# Altium schematic sheet 10.TF.SchDoc
size A4; CheckedBy: YPC; DocumentNumber: 10; Revision: V1.00; SheetNumber: 10; SheetTotal: 18; SheetName: TF; SheetDescribe: TF卡; Designer: JOW; DesignDate: 2025-04-25; CheckedData: 2025-04-25
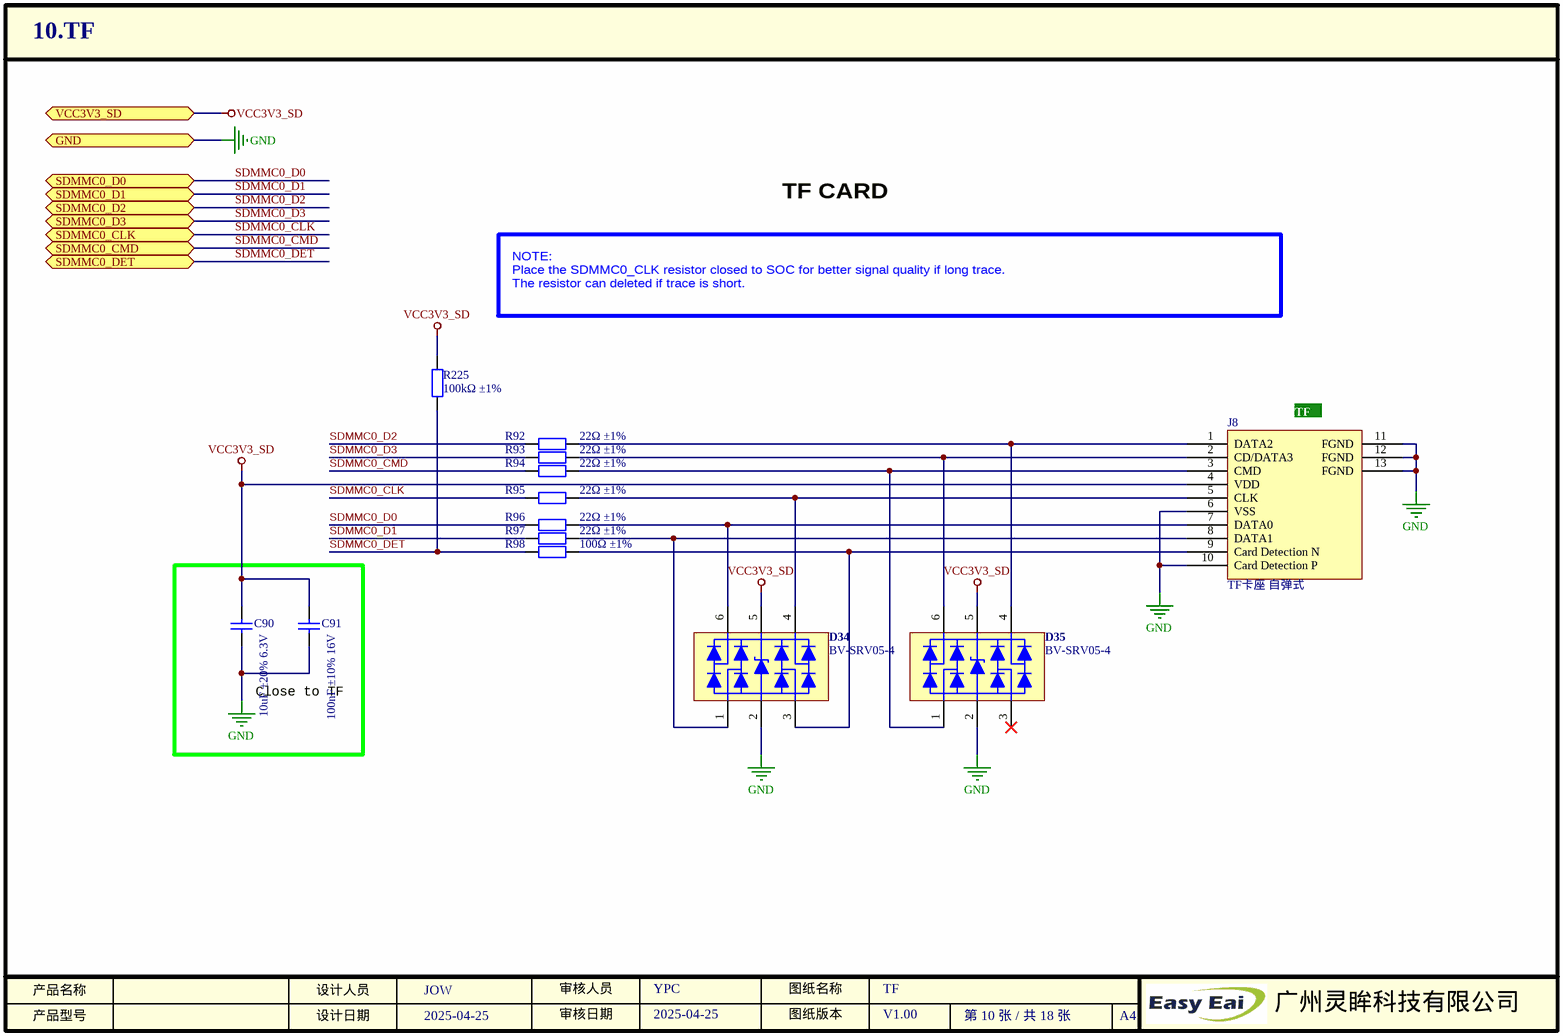
[diagram p0: 10.TF.SchDoc]

## Parts
C90  描述: 10uF ±20% 6.3V  [0402_C]  (hidden comment: CL05A106MQ5NUNC)
C91  描述: 100nF ±10% 16V  [0402_C]  (hidden comment: CL05B104KO5NNNC)
D34  BV-SRV05-4  [SOT-23-6]
D35  BV-SRV05-4  [SOT-23-6]
J8  TF-01A  [TF]  (value not drawn)
R92  描述: 22Ω ±1%  [0402_R]  (hidden comment: 0402WGF220JTCE)
R93  描述: 22Ω ±1%  [0402_R]  (hidden comment: 0402WGF220JTCE)
R94  描述: 22Ω ±1%  [0402_R]  (hidden comment: 0402WGF220JTCE)
R95  描述: 22Ω ±1%  [0402_R]  (hidden comment: 0402WGF220JTCE)
R96  描述: 22Ω ±1%  [0402_R]  (hidden comment: 0402WGF220JTCE)
R97  描述: 22Ω ±1%  [0402_R]  (hidden comment: 0402WGF220JTCE)
R98  描述: 100Ω ±1%  [0402_R]  (hidden comment: 0402WGF1000TCE)
R225  描述: 100kΩ ±1%  [0402_R]  (hidden comment: 0402WGF1003TCE)

## Blocks framed on the sheet
Close to TF: C90 C91

## Ports
GND, SDMMC0_CLK, SDMMC0_CMD, SDMMC0_D0, SDMMC0_D1, SDMMC0_D2, SDMMC0_D3, SDMMC0_DET, VCC3V3_SD

## Nets
GND: C90.1 C91.1 D34.2 D35.2 J8.6(VSS) J8.10(Card_Detection_P) J8.11(FGND) J8.12(FGND) J8.13(FGND) ; port GND
VCC3V3_SD: C90.2 C91.2 D34.5 D35.5 J8.4(VDD) R225.2 ; port VCC3V3_SD
SDMMC0_CLK: R95.1 ; port SDMMC0_CLK
SDMMC0_CMD: R94.1 ; port SDMMC0_CMD
SDMMC0_D0: R96.1 ; port SDMMC0_D0
SDMMC0_D1: R97.1 ; port SDMMC0_D1
SDMMC0_D2: R92.1 ; port SDMMC0_D2
SDMMC0_D3: R93.1 ; port SDMMC0_D3
SDMMC0_DET: R98.1 R225.1 ; port SDMMC0_DET
NetD34_1: D34.1 J8.8(DATA1) R97.2
NetD34_3: D34.3 J8.9(Card_Detection_N) R98.2
NetD34_4: D34.4 J8.5(CLK) R95.2
NetD34_6: D34.6 J8.7(DATA0) R96.2
NetD35_1: D35.1 J8.3(CMD) R94.2
NetD35_4: D35.4 J8.1(DATA2) R92.2
NetD35_6: D35.6 J8.2(CD/DATA3) R93.2

Not connected (* = marked no-connect by the designer): D35 3*

## Notes on the sheet
- TF CARD
- NOTE:
  Place the SDMMC0_CLK resistor closed to SOC for better signal quality if long trace.
  The resistor can deleted if trace is short.
- (near J8) TF
- 产品名称
- 产品型号
- 设计人员
- 设计日期
- 审核人员
- 审核日期
- 图纸版本
- 图纸名称
- A4
- 广州灵眸科技有限公司

## Library data of the parts
C90 = 0402 10uF ±20% 6.3V: SPZL000269; 名称: 贴片电容; 厂商: SAMSUNG(三星); 封装: 0402; 工作温度: -55~85℃; 贴片和直插: SMD; 型号: CL05A106MQ5NUNC; SuppliersPartNumber: C15525; 商品编号: SPZL000269
C91 = 0402 100nF ±10% 16V: SPZL000259; 名称: 贴片电容; 厂商: SAMSUNG(三星); 封装: 0402; 工作温度: -55~125℃; 贴片和直插: SMD; 型号: CL05B104KO5NNNC; SuppliersPartNumber: C1525; 商品编号: SPZL000259
D34 D35 = ESD BV-SRV05-4: SPZL000615; 名称: ESD; 厂商: Bencent(槟城); 贴片和直插: SMD; 描述: Vdrm=5V Cj=1.8pF; 工作温度: -55~125℃; 封装: SOT-23-6; SuppliersPartNumber: C409437; 商品编号: SPZL000615; 型号: BV-SRV05-4
J8 = TF卡座 自弹式: SPZL000144; 名称: TF卡座; 厂商: 韩国韩荣; 贴片和直插: SMD; 工作温度: -40~85℃; SuppliersPartNumber: C91145; 封装: SMD; 型号: TF-01A; 商品编号: SPZL000144; 描述: TF卡座 自弹式
R92-R97 = 0402 22Ω ±1%: SPZL000279; 封装: 0402; 厂商: UNI-ROYAL(厚声); 贴片和直插: SMD; 名称: 电阻; 工作温度: -55~155℃; SuppliersPartNumber: C25092; 型号: 0402WGF220JTCE; 商品编号: SPZL000279
R98 = 0402 100Ω ±1%: SPZL000281; 封装: 0402; 厂商: UNI-ROYAL(厚声); 贴片和直插: SMD; 名称: 电阻; 工作温度: -55~155℃; SuppliersPartNumber: C25076; 型号: 0402WGF1000TCE; 商品编号: SPZL000281
R225 = 0402 100kΩ ±1%: SPZL000282; 封装: 0402; 厂商: UNI-ROYAL(厚声); 贴片和直插: SMD; 名称: 电阻; 工作温度: -55~155℃; SuppliersPartNumber: C25741; 型号: 0402WGF1003TCE; 商品编号: SPZL000282